# EAGLE design whatnick (EAGLE 7.6.0)
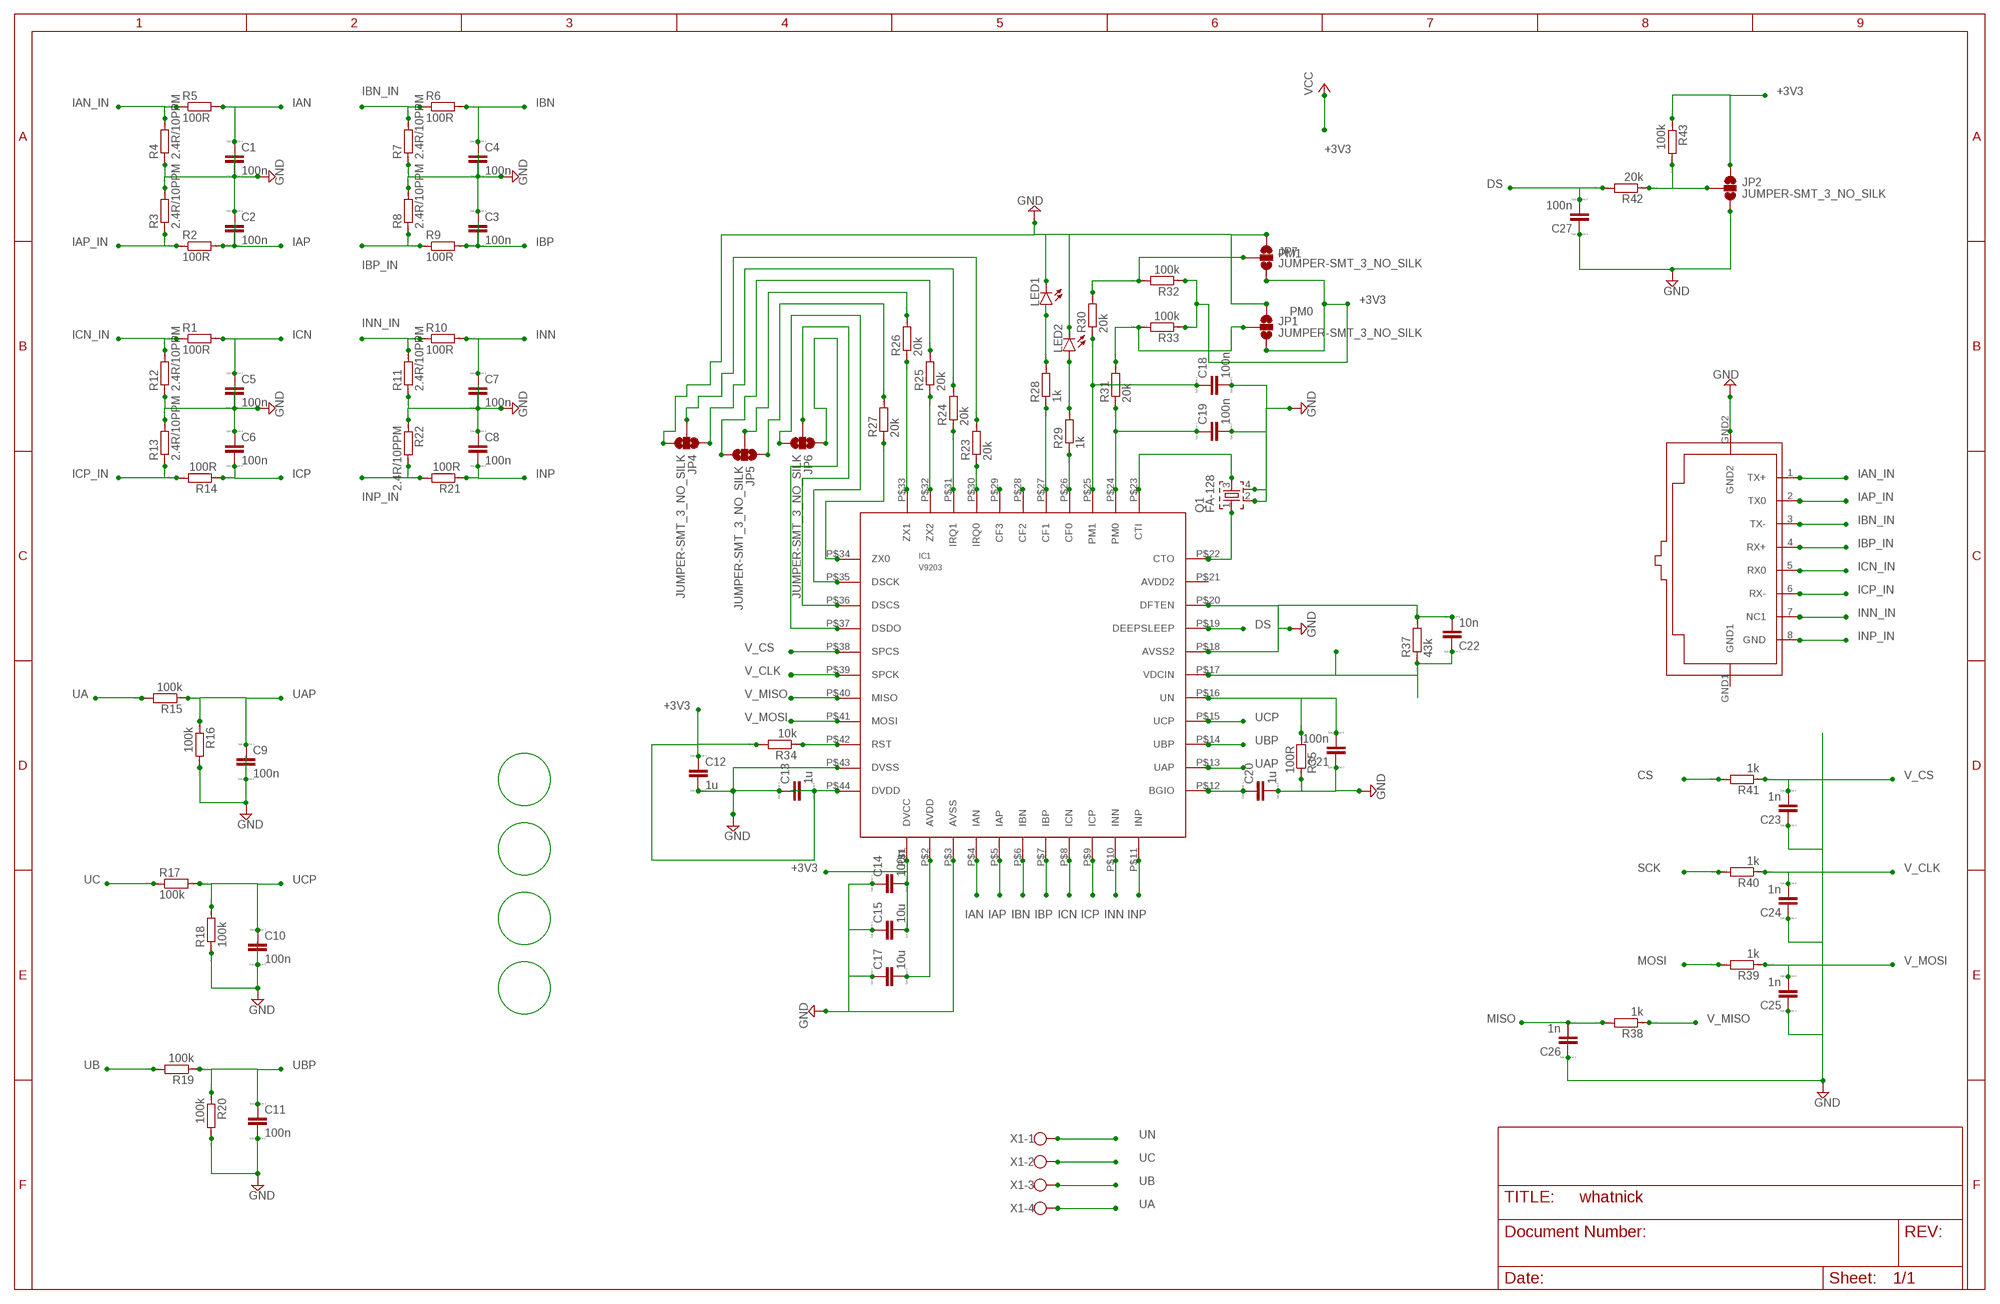
[diagram p0: schematic, sheet 1, part 1 of 2]
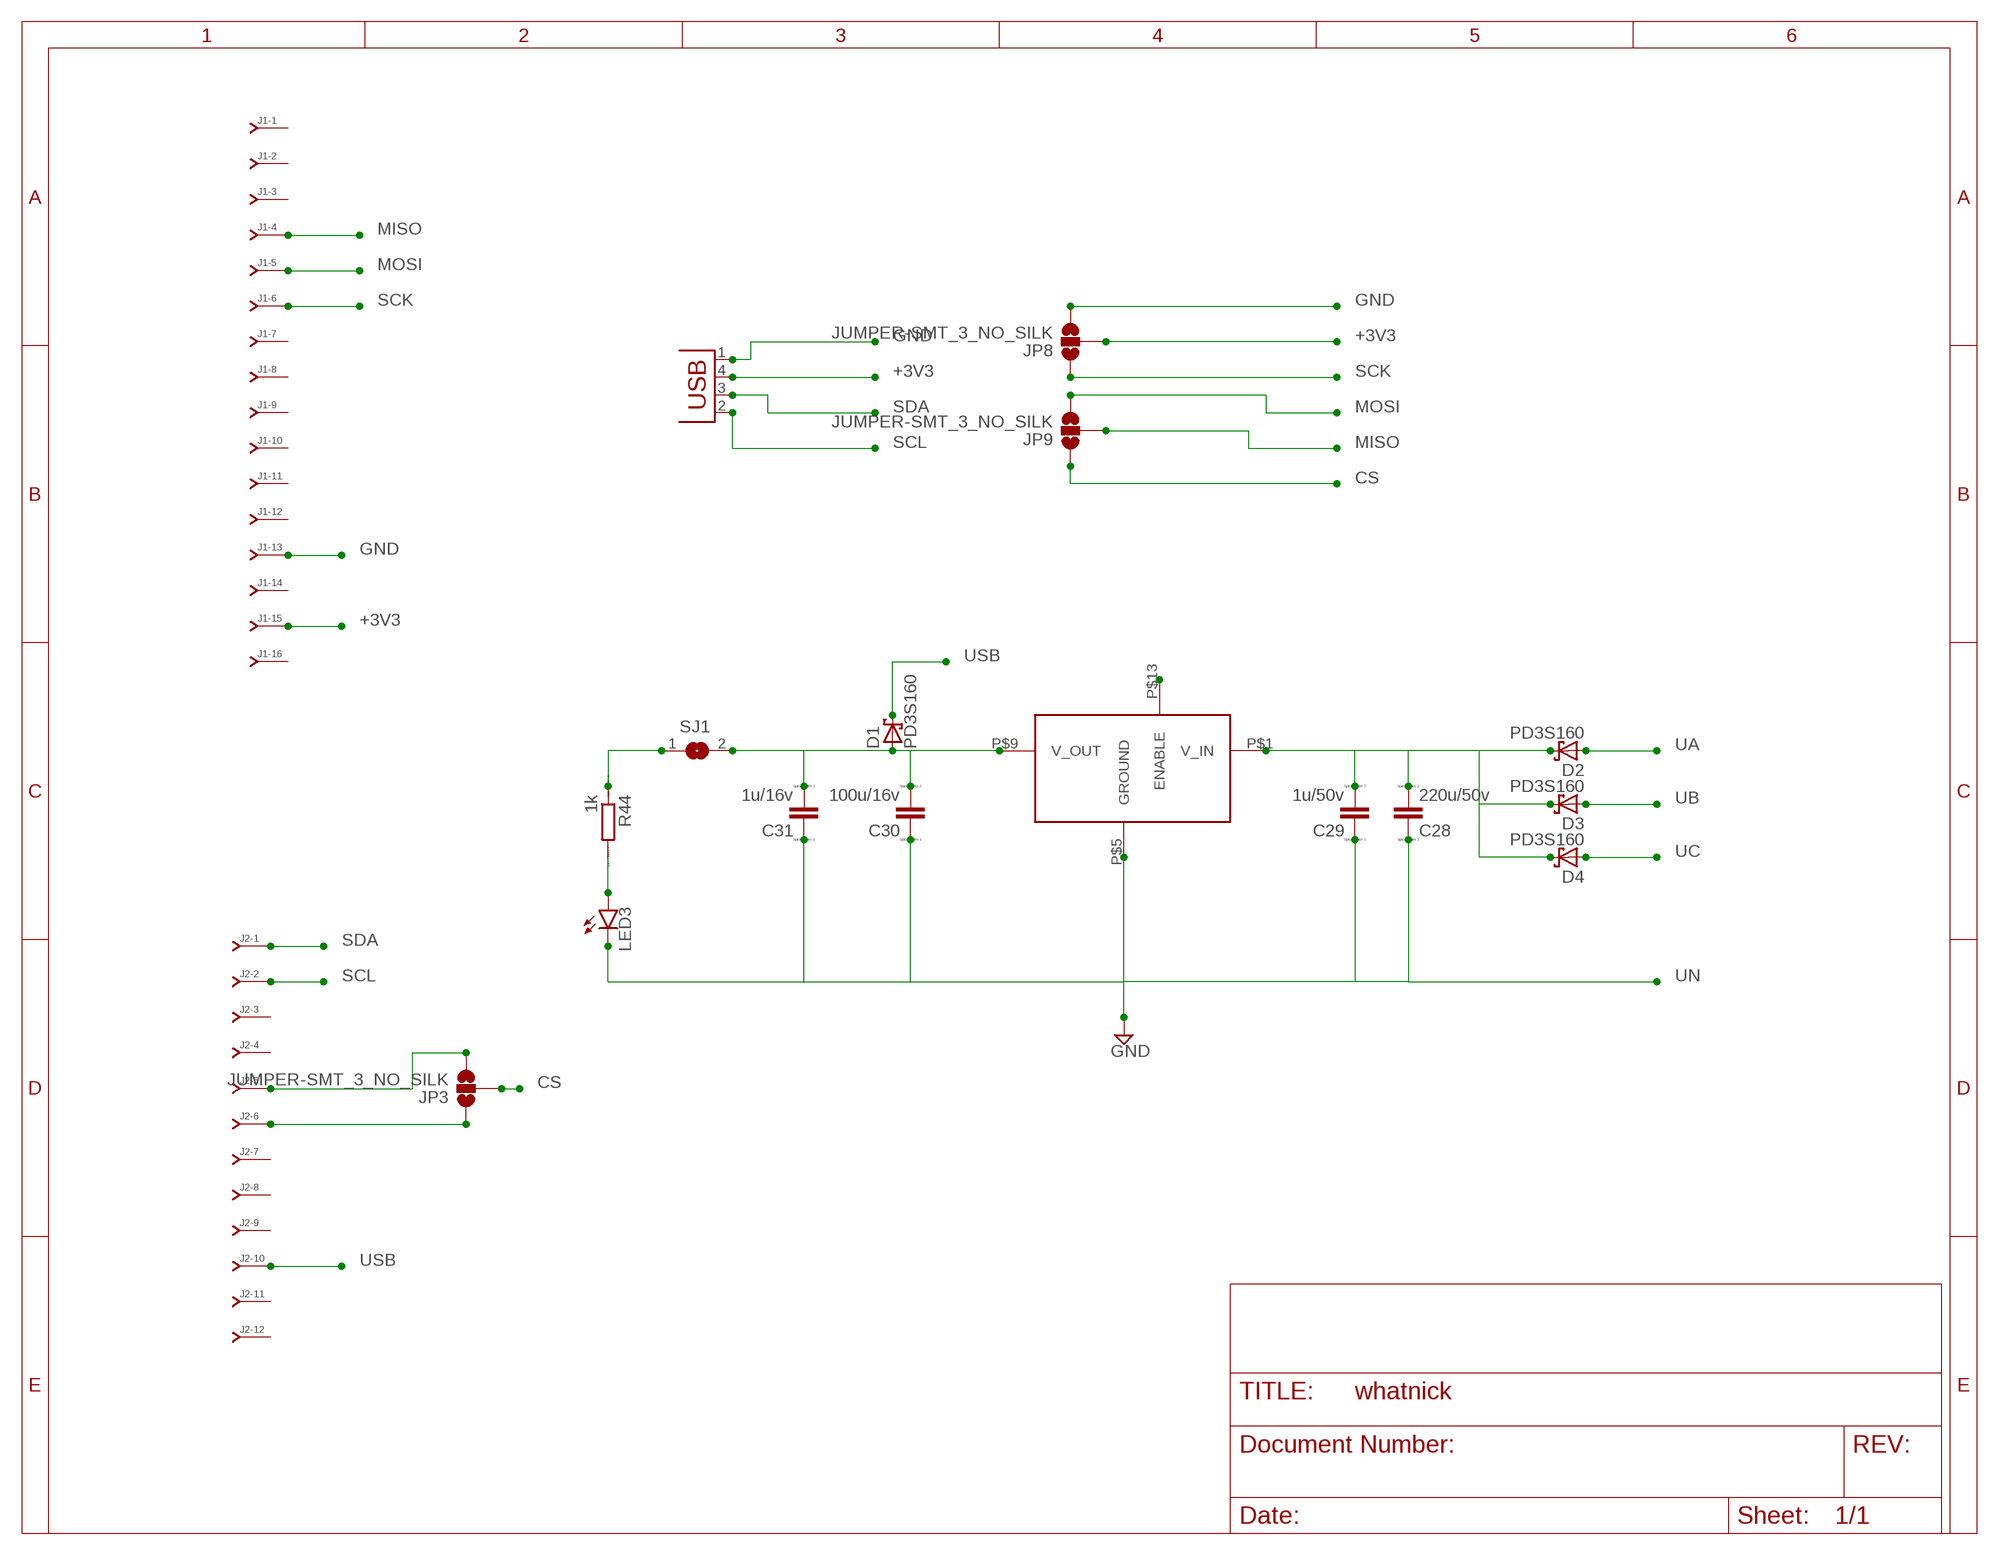
[diagram p1: schematic, sheet 1, part 2 of 2]

## Parts
C1  100n  CC0402  [C0402]
C2  100n  CC0402  [C0402]
C3  100n  CC0402  [C0402]
C4  100n  CC0402  [C0402]
C5  100n  CC0402  [C0402]
C6  100n  CC0402  [C0402]
C7  100n  CC0402  [C0402]
C8  100n  CC0402  [C0402]
C9  100n  CC0402  [C0402]
C10  100n  CC0402  [C0402]
C11  100n  CC0402  [C0402]
C12  1u  CC0402  [C0402]
C13  1u  CC0402  [C0402]
C14  100n  CC0402  [C0402]
C15  10u  CC0402  [C0402]
C17  10u  CC0402  [C0402]
C18  100n  CC0402  [C0402]
C19  100n  CC0402  [C0402]
C20  1u  CC0402  [C0402]
C21  100n  CC0402  [C0402]
C22  10n  CC0402  [C0402]
C23  1n  CC0402  [C0402]
C24  1n  CC0402  [C0402]
C25  1n  CC0402  [C0402]
C26  1n  CC0402  [C0402]
C27  100n  CC0402  [C0402]
C28  220u/50v  CC0402  [C0402]
C29  1u/50v  CC0402  [C0402]
C30  100u/16v  CC0402  [C0402]
C31  1u/16v  CC0402  [C0402]
D1  PD3S160  [POWERDI323]
D2  PD3S160  [POWERDI323]
D3  PD3S160  [POWERDI323]
D4  PD3S160  [POWERDI323]
IC1  V9203  [44LQFP]
J1  J-16-SIP-100  [SIP-100-16]
J2  J-12-SIP-100  [SIP-100-12]
JP1  JUMPER-SMT_3_NO_SILK  [SMT-JUMPER_3_NO_SILK]
JP2  JUMPER-SMT_3_NO_SILK  [SMT-JUMPER_3_NO_SILK]
JP3  JUMPER-SMT_3_NO_SILK  [SMT-JUMPER_3_NO_SILK]
JP4  JUMPER-SMT_3_NO_SILK  [SMT-JUMPER_3_NO_SILK]
JP5  JUMPER-SMT_3_NO_SILK  [SMT-JUMPER_3_NO_SILK]
JP6  JUMPER-SMT_3_NO_SILK  [SMT-JUMPER_3_NO_SILK]
JP7  JUMPER-SMT_3_NO_SILK  [SMT-JUMPER_3_NO_SILK]
JP8  JUMPER-SMT_3_NO_SILK  [SMT-JUMPER_3_NO_SILK]
JP9  JUMPER-SMT_3_NO_SILK  [SMT-JUMPER_3_NO_SILK]
LED1  LEDCHIPLED-0603-TTW  [CHIPLED-0603-TTW]
LED2  LEDCHIPLED-0603-TTW  [CHIPLED-0603-TTW]
LED3  LEDCHIPLED-0603-TTW  [CHIPLED-0603-TTW]
Q1  FA-128  [FA-128]
R1  100R  RR0402  [R0402]
R2  100R  RR0402  [R0402]
R3  2.4R/10PPM  RR0402  [R0402]
R4  2.4R/10PPM  RR0402  [R0402]
R5  100R  RR0402  [R0402]
R6  100R  RR0402  [R0402]
R7  2.4R/10PPM  RR0402  [R0402]
R8  2.4R/10PPM  RR0402  [R0402]
R9  100R  RR0402  [R0402]
R10  100R  RR0402  [R0402]
R11  2.4R/10PPM  RR0402  [R0402]
R12  2.4R/10PPM  RR0402  [R0402]
R13  2.4R/10PPM  RR0402  [R0402]
R14  100R  RR0402  [R0402]
R15  100k  RR1206  [R1206]
R16  100k  RR0402  [R0402]
R17  100k  RR1206  [R1206]
R18  100k  RR0402  [R0402]
R19  100k  RR1206  [R1206]
R20  100k  RR0402  [R0402]
R21  100R  RR0402  [R0402]
R22  2.4R/10PPM  RR0402  [R0402]
R23  20k  RR0402  [R0402]
R24  20k  RR0402  [R0402]
R25  20k  RR0402  [R0402]
R26  20k  RR0402  [R0402]
R27  20k  RR0402  [R0402]
R28  1k  RR0402  [R0402]
R29  1k  RR0402  [R0402]
R30  20k  RR0402  [R0402]
R31  20k  RR0402  [R0402]
R32  100k  RR0402  [R0402]
R33  100k  RR0402  [R0402]
R34  10k  RR0402  [R0402]
R35  100R  RR0402  [R0402]
R37  43k  RR0402  [R0402]
R38  1k  RR0402  [R0402]
R39  1k  RR0402  [R0402]
R40  1k  RR0402  [R0402]
R41  1k  RR0402  [R0402]
R42  20k  RR0402  [R0402]
R43  100k  RR0402  [R0402]
R44  1k  RR0402  [R0402]
SJ1  SJW  [SJW]
U$1  RJ45-TRAFO  [RJ45-TRAFO]
U$2  ROF-78EXX-0.5SMD  [ROF-78EXX-0.5SMD]
X1  W237-4  [W237-4]
X5  USB-JST-2MM-SMT  [S4B-PH]

## Nets
+3V3: C12.1 C13.2 C14.2 C15.2 C22.1 IC1.P$1(DVCC) IC1.P$17(VDCIN) IC1.P$44(DVDD) J1.15 JP1.3 JP2.1 JP7.3 JP8.2 R32.1 R33.1 R34.2 R37.1 R43.1 X5.4(VBUS) ; supply symbol labelled VCC
CS: JP3.2 JP9.1 R41.2
DS: C27.2 IC1.P$19(DEEPSLEEP) R42.2
DSCK: IC1.P$35(DSCK) JP6.3
DSCS: IC1.P$36(DSCS) JP6.2
DSDO: IC1.P$37(DSDO) JP6.1
GND: C1.2 C2.1 C3.1 C4.2 C5.2 C6.1 C7.2 C8.1 C9.2 C10.2 C11.2 C12.2 C13.1 C14.1 C15.1 C17.1 C18.2 C19.2 C20.2 C21.1 C22.2 C23.1 C24.1 C25.1 C26.1 C27.1 IC1.P$3(AVSS) IC1.P$18(AVSS2) IC1.P$20(DFTEN) IC1.P$43(DVSS) J1.13 JP1.1 JP2.3 JP4.3 JP7.1 JP8.3 LED1.C@1(CATHODE) LED2.C@1(CATHODE) Q1.2 Q1.4 R3.2 R4.1 R7.1 R8.2 R11.1 R12.1 R13.2 R16.2 R18.1 R20.2 R22.1 R35.1 R37.2 X5.1(GND)
GND2: U$1.GND2 ; supply symbol labelled GND
IAN: C1.1 IC1.P$4(IAN) R5.2
IAN_IN: R4.2 R5.1 U$1.1(TX+)
IAP: C2.2 IC1.P$5(IAP) R2.2
IAP_IN: R2.1 R3.1 U$1.2(TX0)
IBN: C4.1 IC1.P$6(IBN) R6.2
IBN_IN: R6.1 R7.2 U$1.3(TX-)
IBP: C3.2 IC1.P$7(IBP) R9.2
IBP_IN: R8.1 R9.1 U$1.4(RX+)
ICN: C5.1 IC1.P$8(ICN) R1.2
ICN_IN: R1.1 R12.2 U$1.5(RX0)
ICP: C6.2 IC1.P$9(ICP) R14.1
ICP_IN: R13.1 R14.2 U$1.6(RX-)
INN: C7.1 IC1.P$10(INN) R10.2
INN_IN: R10.1 R11.2 U$1.7(NC1)
INP: C8.2 IC1.P$11(INP) R21.1
INP_IN: R21.2 R22.2 U$1.8(GND)
IRQ0: JP4.2 R23.2
IRQ1: JP4.1 R24.2
MISO: C26.2 J1.4 JP9.2 R38.2
MOSI: J1.5 JP9.3 R39.2
N$1: LED3.A@1(ANODE) R44.2
N$2: JP2.2 R42.1 R43.2
N$3: LED1.A@1(ANODE) R28.2
N$4: IC1.P$23(CTI) Q1.3
N$6: C20.1 IC1.P$12(BGIO)
N$7: LED2.A@1(ANODE) R29.2
N$8: IC1.P$22(CTO) Q1.1
N$9: IC1.P$34(ZX0) R27.1
N$10: IC1.P$28(CF2)
N$11: C21.2 IC1.P$16(UN) R35.2
N$12: IC1.P$29(CF3)
N$13: IC1.P$30(IRQ0) R23.1
N$14: IC1.P$31(IRQ1) R24.1
N$15: IC1.P$32(ZX2) R25.1
N$16: IC1.P$33(ZX1) R26.1
N$19: C19.1 IC1.P$24(PM0) R31.1
N$20: C18.1 IC1.P$25(PM1) R30.1
N$22: IC1.P$27(CF1) R28.1
N$24: IC1.P$26(CF0) R29.1
N$28: IC1.P$42(RST) R34.1
N$37: C17.2 IC1.P$2(AVDD)
N$40: J2.5 JP3.3
N$41: C30.2 C31.2 D1.A SJ1.2 U$2.P$9(V_OUT)
N$48: C28.2 C29.2 D2.C D3.C D4.C U$2.P$1(V_IN)
N$49: J2.6 JP3.1
N$54: U$2.P$13(ENABLE)
N$60: R44.1 SJ1.1
PM0: JP1.2 R31.2 R33.2
PM1: JP7.2 R30.2 R32.2
SCK: J1.6 JP8.1 R40.2
SCL: J2.2 X5.2(D+)
SDA: J2.1 X5.3(D-)
UA: D2.A R15.2 X1.4
UAP: C9.1 IC1.P$13(UAP) R15.1 R16.1
UB: D3.A R19.2 X1.3
UBP: C11.1 IC1.P$14(UBP) R19.1 R20.1
UC: D4.A R17.1 X1.2
UCP: C10.1 IC1.P$15(UCP) R17.2 R18.2
UN: C28.1 C29.1 C30.1 C31.1 LED3.C@1(CATHODE) U$2.P$5(GROUND) X1.1 ; supply symbol labelled GND
USB: D1.C J2.10
V_CLK: C24.2 IC1.P$39(SPCK) R40.1
V_CS: C23.2 IC1.P$38(SPCS) R41.1
V_MISO: IC1.P$40(MISO) R38.1
V_MOSI: C25.2 IC1.P$41(MOSI) R39.1
ZX0: JP5.1 R27.2
ZX1: JP5.2 R26.2
ZX2: JP5.3 R25.2
Unconnected: IC1.P$21(AVDD2) J1.1 J1.2 J1.3 J1.7 J1.8 J1.9 J1.10 J1.11 J1.12 J1.14 J1.16 J2.3 J2.4 J2.7 J2.8 J2.9 J2.11 J2.12 U$1.GND1

## Library data of the parts
C1-C15 C17-C31 = eagle-ltspice:C: CAPACITOR, European symbol; SPICEMODEL: NONE; SPICEPREFIX: C
D1-D4 = diode:PD3S160: 1.0A SURFACE MOUNT SCHOTTKY BARRIER RECTIFIER POWERDI ® 323 Source: http://www.diodes.com/datasheets/ds30899.pdf
IC1 = v9203:V9203
J1 = con-headers-jp:J-16-: HEADER JACK PINS
J2 = con-headers-jp:J-12-: HEADER JACK PINS
JP1-JP9 = SparkFun-Jumpers:JUMPER-SMT_3_NO: Normally open jumper This jumper has three pads in close proximity to each other. Apply solder to close the connection(s).
LED1-LED3 = tango:LED: LED OSRAM: - CHIPLED LG R971, LG N971, LY N971, LG Q971, LY Q971, LO R971, LY R971 LH N974, LH R974 LS Q976, LO Q976, LY Q976 LO Q996 - Hyper CHIPLED LW Q18S LB Q993, LB Q99A, LB R99A - SideLED LS A670, LO A670, LY A670, LG A670, LP A670 LB A673, LV A673, LT A673, LW A673 LH A674 LY A675 LS A676, LA A676, LO A676, LY A676, LW A676 LS A679, LY A679, LG A679 - Hyper Micro SIDELED® LS Y876, LA Y876, LO Y876, LY Y876 LT Y87S - SmartLED LW L88C, LW L88S LB L89C, LB L89S, LG L890 LS L89K, LO L89K, LY L89K LS L896, LA L896, LO L896, LY L896 - TOPLED LS T670, LO T670, LY T670, LG T670, LP T670 LSG T670, LSP T670, LSY T670, LOP T670, LYG T670 LG T671, LOG T671, LSG T671 LB T673, LV T673, LT T673, LW T673 LH T674 LS T676, LA T676, LO T676, LY T676, LB T676, LH T676, LSB T676, LW T676 LB T67C, LV T67C, LT T67C, LS T67K, LO T67K, LY T67K, LW E67C LS E67B, LA E67B, LO E67B, LY E67B, LB E67C, LV E67C, LT E67C LW T67C LS T679, LY T679, LG T679 LS T770, LO T770, LY T770, LG T770, LP T770 LB T773, LV T773, LT T773, LW T773 LH T774 LS E675, LA E675, LY E675, LS T675 LS T776, LA T776, LO T776, LY T776, LB T776 LHGB T686 LT T68C, LB T68C - Hyper Mini TOPLED® LB M676 - Mini TOPLED Santana® LG M470 LS M47K, LO M47K, LY M47K Source: http://www.osram.convergy.de - LUMILED® LXK2-PW12-R00, LXK2-PW12-S00, LXK2-PW14-U00, LXK2-PW14-V00 LXK2-PM12-R00, LXK2-PM12-S00, LXK2-PM14-U00 LXK2-PE12-Q00, LXK2-PE12-R00, LXK2-PE12-S00, LXK2-PE14-T00, LXK2-PE14-U00 LXK2-PB12-K00, LXK2-PB12-L00, LXK2-PB12-M00, LXK2-PB14-N00, LXK2-PB14-P00, LXK2-PB14-Q00 LXK2-PR12-L00, LXK2-PR12-M00, LXK2-PR14-Q00, LXK2-PR14-R00 LXK2-PD12-Q00, LXK2-PD12-R00, LXK2-PD12-S00 LXK2-PH12-R00, LXK2-PH12-S00 LXK2-PL12-P00, LXK2-PL12-Q00, LXK2-PL12-R00 Source: www.luxeon.com
Q1 = crystal:FA-: MHz RANGE CRYSTAL UNIT Source: Epson Toyocom
R1-R35 R37-R44 = eagle-ltspice:R: RESISTOR, European symbol; SPICEMODEL: NONE; SPICEPREFIX: R
SJ1 = jumper:SJ: SMD solder JUMPER
U$1 = con-amphenol-rj45-ld:RJ45-TRAFO: RJ45 socket with integrated magnetics Naming: Amphenol LMJ1598824110DT39 TME RJ45-TRAFO Author: Petr Kalandra <mailto:kalandrap@gmail.com> Datasheet: http://zefiryn.tme.pl/dok/zlacza/rjtrafo.pdf
U$2 = rof-78exx-0.5smd:ROF-78EXX-0.5SMD
X1 = con-wago-500:W237-4: WAGO SCREW CLAMP; OC_FARNELL: unknown; OC_NEWARK: unknown
X5 = DECADE-libraries20151104:USB: USB Connectors USB-B-PTH is fully proven SKU : PRT-00139/CONN-08278 USB-miniB is fully proven SKU : PRT-00587 USB-A-PCB is untested. USB-A-H is throughly reviewed, but untested. Spark Fun Electronics SKU : PRT-00437 USB-B-SMT is throughly reviewed, but untested. Needs silkscreen touching up. USB-A-S has not been used/tested USB-MB-H has not been used/tested USB-MICROB has been used. CONN-09505

## Board
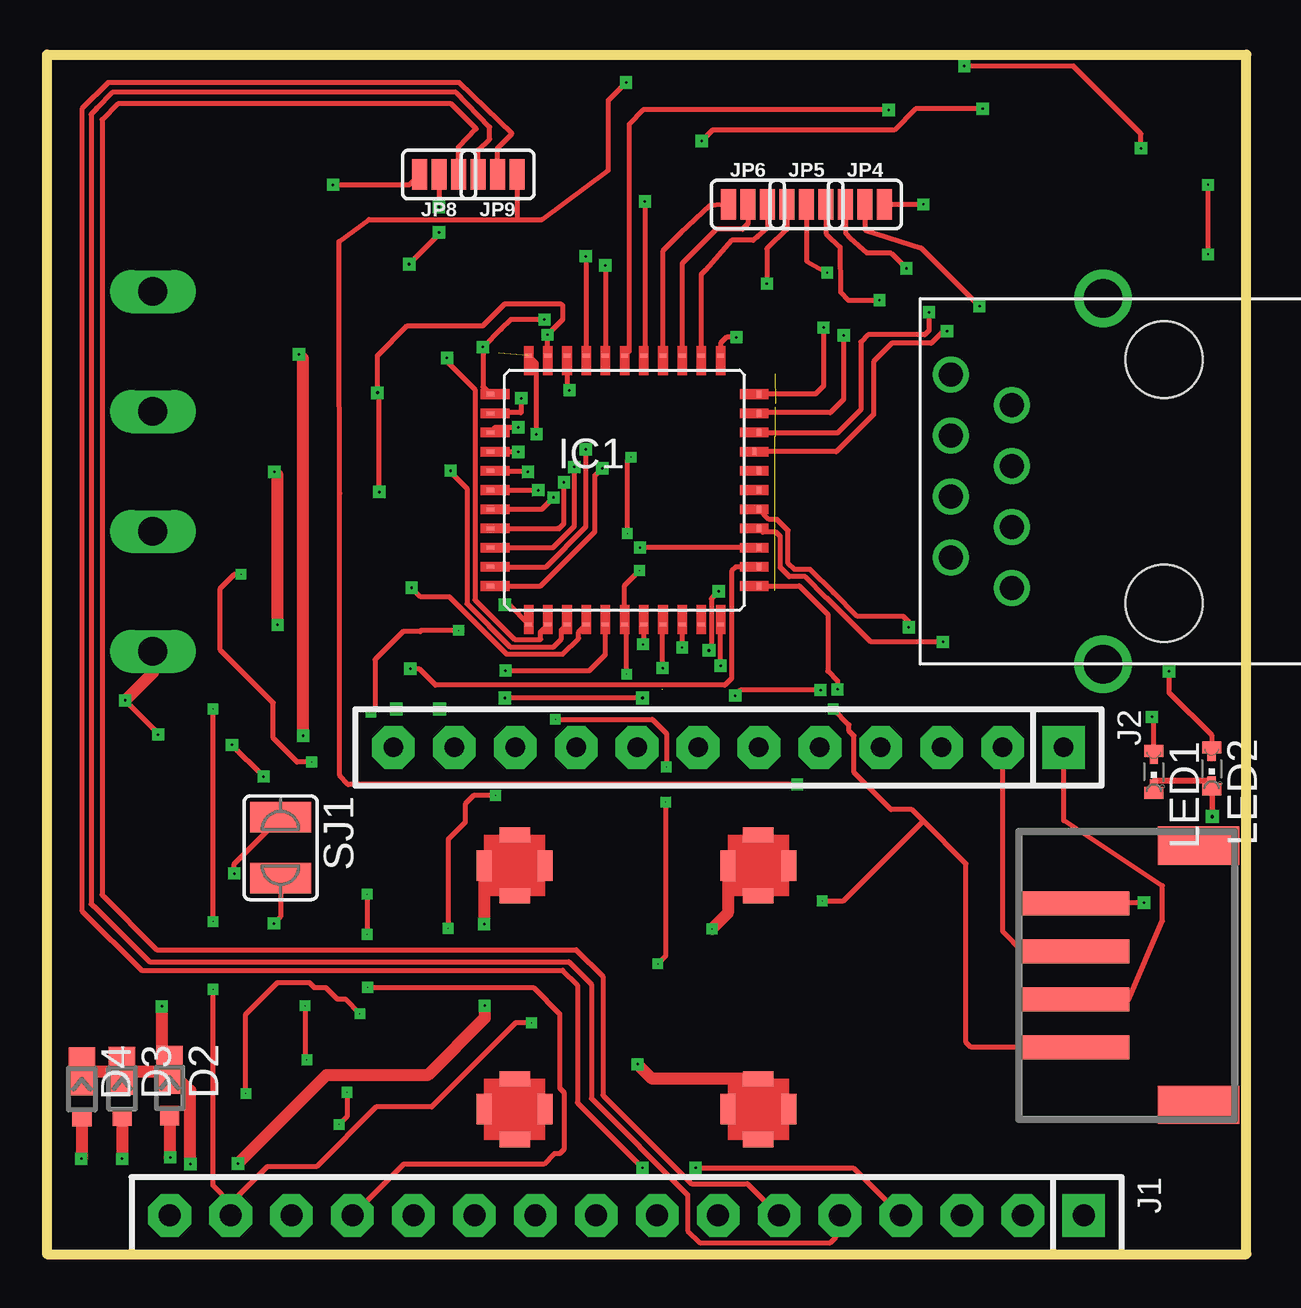
[diagram p2: board, top side]
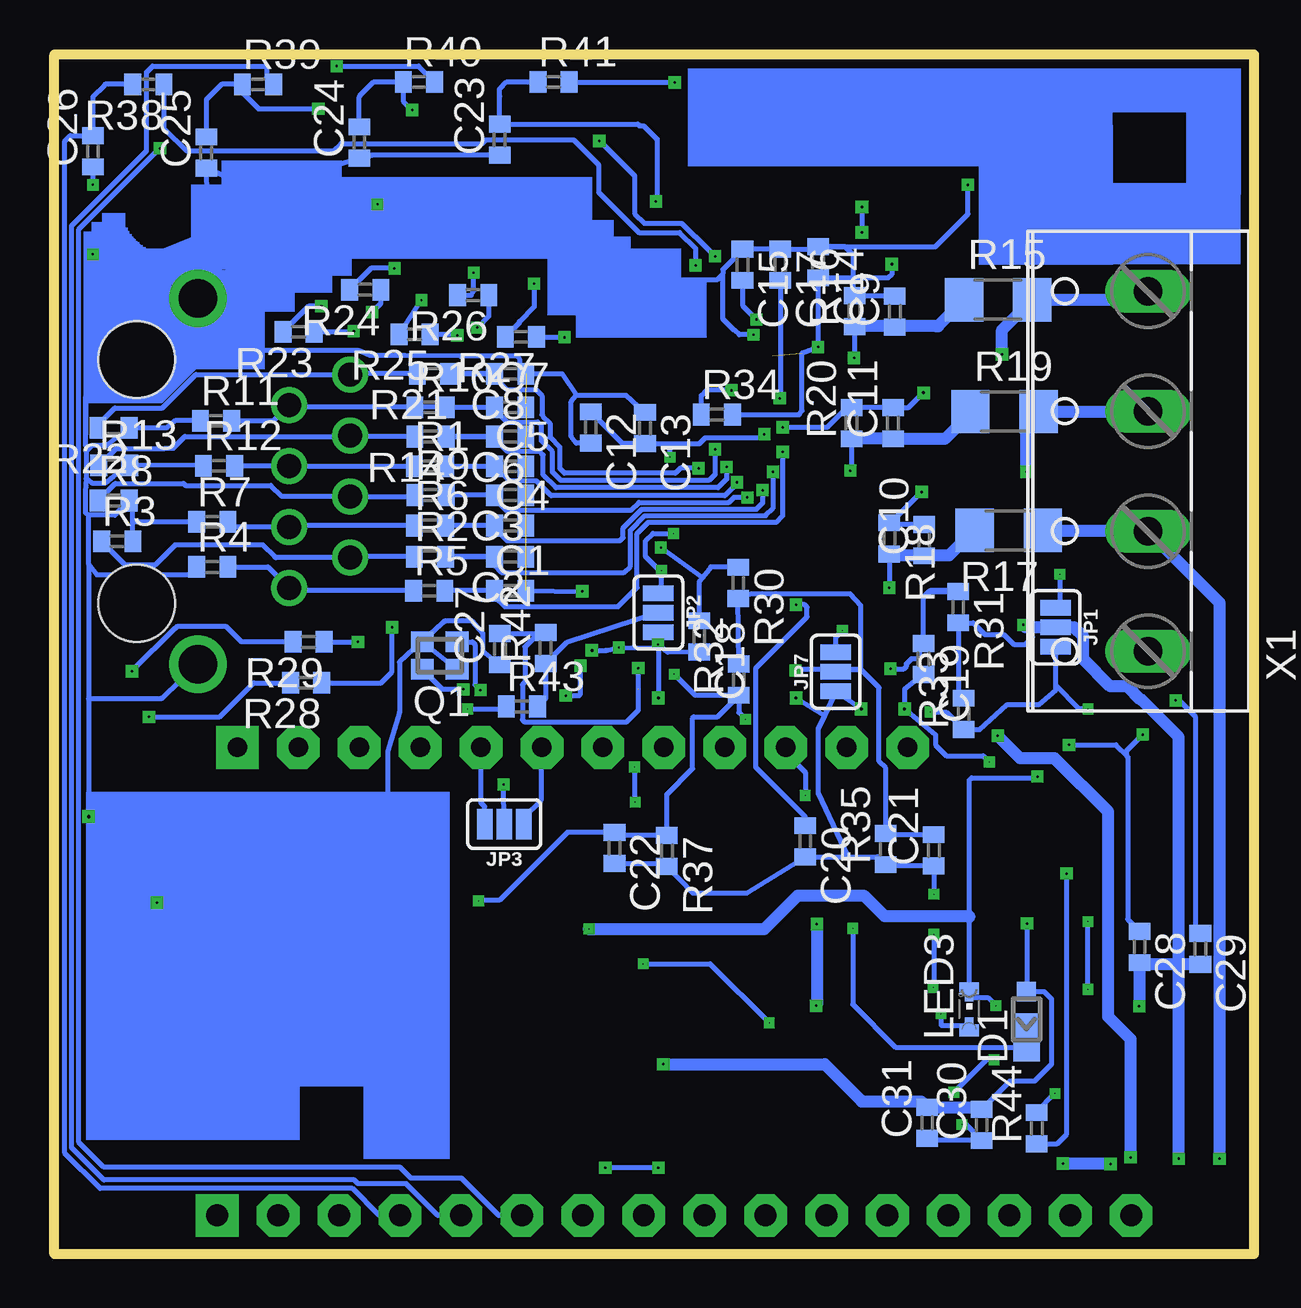
[diagram p3: board, bottom side, seen from below]

No outline drawn. Coordinates in mm, seen from the top.
Copper layers (1*16): Top 0.035mm / dielectric 1.5mm / Bottom 0.035mm
Design rules "default *": minimum track width 10mil, minimum drill 24mil, track to track 8mil, track to pad 8mil, pad to pad 8mil, via to via 8mil, smd to smd 8mil, copper to edge 40mil, drill to drill 8mil, minimum pad ring 5mil, minimum via ring 8mil, stop-mask expansion 4mil, vias tented up to drill 0mil, thermal gap 10mil
Milling: 4 lines

### Footprints (pad centres in the part's own frame; a part is rotated, then mirrored left to right if it is on the bottom)
C0402 = smd 0.7 x 0.9: 1 -0.65,0; 2 0.65,0
POWERDI323 = smd 0.8 x 0.8: A 1.15,0 | smd 2 x 1.1: C -0.75,0
44LQFP = smd 0.305 x 0.152: P$1 -5.4,4; P$2 -5.4,3.2; P$3 -5.4,2.4; P$4 -5.4,1.6; P$5 -5.4,0.8; P$6 -5.4,0; P$7 -5.4,-0.8; P$8 -5.4,-1.6; P$9 -5.4,-2.4; P$10 -5.4,-3.2; P$11 -5.4,-4; P$12 -3.8,-5.6; P$13 -3,-5.6; P$14 -2.2,-5.6; P$15 -1.4,-5.6; P$16 -0.6,-5.6; P$17 0.2,-5.6; P$18 1,-5.6; P$19 1.8,-5.6; P$20 2.6,-5.6; P$21 3.4,-5.6; P$22 4.2,-5.6; P$34 4.2,5.6; P$35 3.4,5.6; P$36 2.6,5.6; P$37 1.8,5.6; P$38 1,5.6; P$39 0.2,5.6; P$40 -0.6,5.6; P$41 -1.4,5.6; P$42 -2.2,5.6; P$43 -3,5.6; P$44 -3.8,5.6 | smd 0.152 x 0.305: P$23 5.8,-4; P$24 5.8,-3.2; P$25 5.8,-2.4; P$26 5.8,-1.6; P$27 5.8,-0.8; P$28 5.8,0; P$29 5.8,0.8; P$30 5.6,1.6; P$31 5.8,2.4; P$32 5.8,3.2; P$33 5.8,4
SIP-100-16 = drill 0.914 pad 1.778 square: 1 -19.05,0 | drill 0.914 pad 1.778 octagon: 2 -16.51,0; 3 -13.97,0; 4 -11.43,0; 5 -8.89,0; 6 -6.35,0; 7 -3.81,0; 8 -1.27,0; 9 1.27,0; 10 3.81,0; 11 6.35,0; 12 8.89,0; 13 11.43,0; 14 13.97,0; 15 16.51,0; 16 19.05,0
SIP-100-12 = drill 0.813 pad 1.778 square: 1 -13.97,0 | drill 0.813 pad 1.778 octagon: 2 -11.43,0; 3 -8.89,0; 4 -6.35,0; 5 -3.81,0; 6 -1.27,0; 7 1.27,0; 8 3.81,0; 9 6.35,0; 10 8.89,0; 11 11.43,0; 12 13.97,0
SMT-JUMPER_3_NO_SILK = smd 0.635 x 1.27: 1 -0.813,0; 2 0,0; 3 0.813,0
CHIPLED-0603-TTW = smd 0.8 x 0.5: A 0,-0.875; C 0,0.875 | smd 0.35 x 0.35: A@1 0,-0.5; C@1 0,0.5
FA-128 = smd 0.95 x 0.85: 1 -0.725,-0.575; 2 0.725,-0.575; 3 0.725,0.575; 4 -0.725,0.575
R0402 = smd 0.7 x 0.9: 1 -0.65,0; 2 0.65,0
R1206 = smd 1.6 x 1.803: 1 -1.422,0; 2 1.422,0
SJW = smd 1.27 x 2.54: 1 -1.27,0; 2 1.27,0
RJ45-TRAFO = drill 1: 1 -4.445,6.35; 2 -3.175,8.89; 3 -1.905,6.35; 4 -0.635,8.89; 5 0.635,6.35; 6 1.905,8.89; 7 3.175,6.35; 8 4.445,8.89 | drill 1.6: GND1 -7.62,2.54; GND2 7.62,2.54 | hole 3.2: -5.08,0; 5.08,0
ROF-78EXX-0.5SMD = smd 0.635 x 1.27: P$1 -12.7,8.89; P$3 -10.16,8.89; P$5 -2.54,8.89; P$7 0,8.89; P$10 0,-1.27; P$12 -2.54,-1.27; P$13 -10.16,-1.27; P$15 -12.7,-1.27 | smd 1.27 x 0.635: P$2 -11.43,10.16; P$4 -11.43,7.62; P$6 -1.27,10.16; P$8 -1.27,7.62; P$9 -1.27,0; P$11 -1.27,-2.54; P$14 -11.43,0; P$16 -11.43,-2.54
W237-4 = drill 1.194 long: 1 -7.5,-1.27; 2 -2.5,-1.27; 3 2.5,-1.27; 4 7.5,-1.27
S4B-PH = smd 1 x 4.6: 1 -3,-4.7; 2 -1,-4.7; 3 1,-4.7; 4 3,-4.7 | smd 1.6 x 3.4: P$1 -5.4,0.5; P$2 5.4,0.5

### Placement (x,y rotation side)
C1  46,52.65 0 bottom
C2  46,54.08 180 bottom
C3  46,56.64 180 bottom
C4  46,55.37 0 bottom
C5  46,57.84 0 bottom
C6  46,59.08 180 bottom
C7  46,60.3 0 bottom
C8  46,61.7 180 bottom
C9  29.97,64.29 90 bottom
C10  28.75,54.76 90 bottom
C11  30.05,59.64 90 bottom
C12  42.65,59.46 270 bottom
C13  40.39,59.44 270 bottom
C14  33.17,66.34 270 bottom
C15  36.32,66.24 270 bottom
C17  34.75,66.24 270 bottom
C18  38.13,50.75 270 bottom
C19  28.78,49.81 270 bottom
C20  33.71,42.21 270 bottom
C21  28.35,41.83 90 bottom
C22  41.66,41.94 270 bottom
C23  46.44,71.46 90 bottom
C24  52.29,71.34 90 bottom
C25  58.67,70.92 90 bottom
C26  63.4,70.97 90 bottom
C27  46.43,50.22 90 bottom
C28  19.77,37.81 270 bottom
C29  17.24,37.73 270 bottom
C30  26.35,30.39 90 bottom
C31  28.62,30.47 90 bottom
D1  24.49,34.8 90 bottom
D2  20.12,31.93 270 top
D3  18.14,31.9 270 top
D4  16.46,31.88 270 top
IC1  38.88,56.85 0 top
J1  39.17,26.62 180 top
J2  43.41,46.12 180 top
JP1  23.27,51.13 270 bottom
JP2  39.83,51.74 270 bottom
JP3  46.25,42.93 180 bottom
JP4  49.1,68.76 0 top
JP5  46.66,68.76 0 top
JP6  44.22,68.76 0 top
JP7  32.44,49.28 90 bottom
JP8  31.34,70 180 top
JP9  33.78,70 180 top
LED1  61.14,45.11 180 top
LED2  63.55,45.24 180 top
LED3  26.87,35.2 0 bottom
Q1  48.94,49.95 180 bottom
R1  49.35,57.84 0 bottom
R2  49.35,54.08 0 bottom
R3  62.38,54.71 0 bottom
R4  58.42,53.64 0 bottom
R5  49.38,52.65 0 bottom
R6  49.35,55.37 0 bottom
R7  58.42,55.52 0 bottom
R8  62.53,56.41 0 bottom
R9  49.33,56.64 0 bottom
R10  49.33,60.3 0 bottom
R11  58.27,59.74 0 bottom
R12  58.14,57.86 0 bottom
R13  62.51,57.89 0 bottom
R14  49.33,59.08 180 bottom
R15  25.67,64.78 0 bottom
R16  31.65,64.31 90 bottom
R17  25.22,55.17 180 bottom
R18  30.2,54.84 270 bottom
R19  25.4,60.12 0 bottom
R20  31.78,59.64 90 bottom
R21  49.23,61.7 180 bottom
R22  62.53,59.44 180 bottom
R23  54.82,63.44 180 bottom
R24  52.05,65.2 180 bottom
R25  49.99,63.34 180 bottom
R26  47.55,64.98 180 bottom
R27  45.56,63.24 180 bottom
R28  54.51,48.82 180 bottom
R29  54.41,50.52 180 bottom
R30  36.5,52.98 270 bottom
R31  27.33,51.97 270 bottom
R32  36.47,48.95 90 bottom
R33  27.1,47.52 90 bottom
R34  37.39,59.99 0 bottom
R35  30.35,41.88 90 bottom
R37  39.47,41.81 270 bottom
R38  61.09,73.76 180 bottom
R39  56.52,73.76 0 bottom
R40  49.81,73.86 0 bottom
R41  44.2,73.86 0 bottom
R42  44.53,50.27 90 bottom
R43  45.52,47.83 0 bottom
R44  24.05,30.25 90 bottom
SJ1  24.74,41.94 270 top
U$1  61.57,57.21 90 top
U$2  45.93,32.31 0 top
X1  20.68,57.63 90 bottom
X5  62.51,36.63 270 top

### Tracks (layer width: path | path; a pad name or v marks a point on that pad's centre or on a via)
+3V3  (via drill 0.04 pad 0.13, 0.1 pad 0.13, 0.12)  (1 unrouted)
  Top 0.203: IC1.P$1 33.17,61.16 v33.17,62.81 33.91,63.55 33.93,63.55 34.34,63.96 v35.74,63.96 | v35.41,59.18 35.41,62.12 IC1.P$44 | JP8.2 v31.34,68.66 | v31.34,67.59 31.34,67.51 v30.1,66.27 | v39.7,53.49 39.08,52.87 IC1.P$17 39.17,51.16 v39.17,49.17 | v39.19,55.04 39.19,58.06 v39.34,58.22 | v32.16,51 30.61,51 30.56,50.95 29.84,50.95 28.68,49.78 28.68,47.78 v28.5,47.6 | X5.4 53.52,33.63 53.31,33.83 53.31,41.27 51.54,43.05 | 51.54,43.05 51.05,43.54 50.19,43.54 48.64,45.09 48.64,46.61 48.44,46.81 48.44,47.07 v47.78,47.73 | v47.32,39.73 48.21,39.73 51.54,43.05 | J1.15 22.66,27.13 | 22.66,27.13 21.92,27.86 v21.92,36.04 | v21.92,38.86 v21.92,47.73 | v36.2,47.3 40.23,47.3 40.82,46.71 v40.82,45.31 | v40.79,43.84 40.79,37.44 v40.46,37.11 | v35.2,34.65 34.54,34.65 31.04,31.14 28.73,31.14 26.24,28.65 24.18,28.65 22.66,27.13
  Bottom 0.203: C15.2 36.32,64.54 v35.74,63.96 | R34.2 33.96,59.99 33.83,60.15 33.83,62.56 v33.17,62.81 C14.2 30.25,65.68 30.1,65.84 v30.1,66.27 | 39.37,58.79 C13.2 41.32,58.79 C12.1 | 39.37,58.79 38.12,58.79 37.87,59.03 35.56,59.03 v35.41,59.18 | v31.34,68.66 v31.34,67.59 | 23.27,48.72 23.27,48.51 23.98,47.9 25.3,47.9 26.44,46.86 R33.1 27.83,47.6 v28.5,47.6 | 23.27,48.72 JP1.3 | v39.7,53.49 39.7,53.44 | 39.7,52.81 39.7,52.68 JP2.1 39.83,52.68 39.7,52.81 | 39.7,52.81 39.7,53.44 | 39.7,53.44 39.73,53.44 40.36,54.08 40.36,54.74 40.06,55.04 v39.19,55.04 | v39.34,58.22 39.34,58.76 39.37,58.79 | JP7.3 32.44,50.72 v32.16,51 | v47.78,47.73 46.27,47.73 R43.1 | v47.32,39.73 47.3,39.75 46.46,39.75 43.62,42.59 C22.1 41.53,42.46 R37.1 39.47,44.17 38.41,45.24 38.41,47.35 38.35,47.4 37.37,47.4 R32.1 | R32.1 38.29,48.3 v39.17,49.17 | v21.92,36.04 v21.92,38.86 | v21.92,47.73 22.28,47.73 23.27,48.72 | R32.1 36.47,47.57 v36.2,47.3 | v40.82,45.31 40.82,43.87 v40.79,43.84 | v40.46,37.11 37.67,37.11 v35.2,34.65
CS  (via drill 0.08 pad 0.25, 0.1 pad 0.13)
  Top 0.203: v39.14,73.84 38.41,73.1 38.41,70.18 35.64,68.12 34.59,68.12 | v46.28,44.58 27.56,44.58 27.2,44.96 27.2,56.72 27.18,63.91 27.18,67.21 28.42,68.12 34.59,68.12 | JP9.1 34.59,68.12
  Bottom 0.203: v39.14,73.84 43.52,73.84 R41.2 | JP3.2 v46.28,44.58
DS  (via drill 0.1 pad 0.13)  (1 unrouted)
  Top 0.203: v40.66,49.43 40.66,51.24 IC1.P$19
  Bottom 0.203: C27.2 44.58,50.87 R42.2 44.79,50.92 45.39,50.32 45.39,48.84 45.49,48.74 45.49,47.27 45.41,47.19 41.15,47.19 40.66,47.68 40.66,48.54 | 40.66,48.56 v40.66,49.43
DSCK
  Top 0.203: IC1.P$35 42.27,62.47 42.27,65.84 42.44,66.02 43.54,67.26 44.45,67.26 44.63,67.41 45.03,67.77 JP6.3
DSCS
  Top 0.203: IC1.P$36 41.48,66.29 42.9,67.72 43.99,67.72 44.22,67.94 JP6.2
DSDO
  Top 0.203: IC1.P$37 40.66,62.47 40.66,66.8 41.41,67.55 42.65,68.71 JP6.1
GND  (via drill 0.04 pad 0.13, 0.08 pad 0.25, 0.09, 0.12)  (7 unrouted)
  Top 0.203: v63.4,69.57 v63.4,66.67 | JP4.3 v51.54,68.76 | IC1.P$20 v41.48,50.29 | IC1.P$18 v39.85,50.42 | IC1.P$43 35.87,62.45 v35.87,63.32 36.5,63.96 36.5,64.54 36.42,64.62 34.09,64.62 33.17,63.7 30.02,63.7 28.78,62.46 v28.78,60.91 28.85,60.83 v28.85,56.77 | v26.92,69.57 30.1,69.57 JP8.3 | v34.65,59.46 33.69,59.46 IC1.P$3 | v63.58,43.26 63.58,44.74 LED2.C@1 61.19,44.74 LED1.C@1 61.14,44.73 63.55,44.73 63.55,44.76 63.58,44.76 | 63.6,44.76 63.58,44.76 | 63.58,44.76 v63.58,43.23 | v60.73,39.65 57.83,39.65 X5.1 | v43,52.63 42.7,52.32 42.7,50.29 v42.6,50.16 | v29.57,47.73 v31.37,47.73 | v39.83,48.18 v34.09,48.18 | v26.04,45.52 25.43,45.52 24.43,46.51 24.43,47.98 22.23,50.19 22.23,52.76 22.81,53.34 v23.09,53.34 | v28.35,40.01 v28.35,38.33 | v28.37,36.12 35.28,36.12 36.37,35.03 36.37,31.93 36.55,31.75 36.55,29.36 36.37,29.18 36.14,29.18 35.71,28.75 29.87,28.75 J1.13
  Bottom 0.051: 63.63,58.65 63.7,59.16
  Bottom 0.203: R3.2 61.73,55.47 | 61.73,55.47 61.73,56.26 R8.2 62.48,55.8 63.58,55.8 | R7.1 61.68,55.52 61.73,55.47 | 31.93,41.56 C20.2 36.14,40.06 38.41,40.06 R37.2 39.6,41.28 C22.2 | 31.93,41.56 30.68,41.56 R35.1 30.3,41.18 C21.1 v28.35,40.01 | R11.1 59.97,59.74 60.33,59.44 R22.1 62.84,58.7 63.45,58.7 | 63.45,58.7 63.68,58.47 63.68,57.33 | 63.58,55.8 63.68,55.88 63.7,55.91 63.7,56.67 63.68,57.17 63.68,57.33 | 63.68,57.33 63.45,57.15 62.89,57.15 62.53,57.43 R13.2 R12.1 | R4.1 59.31,53.31 63.22,53.31 | 63.58,53.77 63.58,55.8 | 56.52,69.32 C24.1 51.77,70.81 C23.1 | 56.52,69.32 C25.1 58.62,66.67 | C26.1 v63.4,69.57 | 63.17,66.67 v63.4,66.67 58.62,66.67 | 56.52,69.32 v51.54,68.76 50.44,67.67 43.89,67.67 41.83,65.61 37.39,65.61 37.19,65.81 | 58.62,66.67 61.28,63.68 | 61.28,63.68 63.6,61.06 63.7,60.53 63.7,59.16 | 63.45,58.7 63.6,58.57 63.63,58.65 | v39.85,50.42 JP2.3 | v39.85,50.42 39.85,50.27 v41.48,50.29 42.01,50.16 v42.6,50.16 | 39.45,50.09 v39.85,50.42 | C12.2 43.26,58.8 43.46,59.08 43.46,60.53 43.23,60.81 | 43.23,60.81 41.17,60.81 C13.1 | 43.23,60.81 43.84,61.7 C8.1 45.59,62.03 45.59,62.28 45.7,62.43 48.08,62.43 50.39,62.46 51.84,62.46 52.32,62.66 57.2,62.66 61.28,63.68 | v35.87,63.32 36.45,63.32 36.63,63.5 36.65,63.5 37.13,63.98 37.13,65.81 | 37.13,65.81 37.13,65.86 | 37.13,65.86 37.19,65.81 | 37.13,65.86 37.13,66.04 36.32,66.85 C15.1 C17.1 33.17,66.89 C14.1 | 37.13,65.81 37.19,65.81 | C9.2 31.65,64.94 R16.2 31.7,64.96 31.7,66.65 32.05,67 33.16,67 C14.1 | C14.1 28.28,67 26.92,68.35 v26.92,69.57 | v34.65,59.46 32.79,59.46 31.96,60.29 R20.2 C11.2 29.4,60.29 v28.78,60.91 | C10.2 30.12,55.41 R18.1 30.14,55.49 v28.85,56.77
  Bottom 0.203: 63.25,53.34 63.22,53.31 | 63.22,53.31 63.58,53.77 | 63.58,53.77 63.58,48.16 | 63.58,48.16 v63.58,43.26 | v63.58,43.23 63.58,40.06 63.17,39.65 v60.73,39.65 59.89,40.56 51.1,43.61 51.1,45.95 50.62,47.6 50.62,49.68 50.04,50.22 49.33,50.85 48.72,51.38 | Q1.4 Q1.2 48.74,51.38 48.72,51.38 | C27.1 47.14,50.11 47.14,50.88 | 47.14,50.88 47.57,51.38 | C7.2 45.36,60.45 | C1.2 v43,52.63 | 47.14,50.88 47.55,51.36 47.57,51.38 | 47.57,51.38 48.72,51.38 | 63.58,48.16 60.55,48.16 60.55,48.18 60.5,48.18 59.77,48.92 | 29.57,48.54 C19.2 28.87,49.16 29.13,48.9 29.57,48.54 | 29.57,47.75 v29.57,47.73 | v31.37,47.73 JP7.1 32.91,47.46 | 32.91,47.46 33.17,46.89 33.17,44.22 31.93,41.56 | C18.2 39.45,50.09 | 39.45,50.09 39.75,50.34 39.83,50.39 v39.83,48.18 | v34.09,48.18 32.91,47.46 | 29.57,48.54 29.57,47.75 | 29.57,47.75 28.27,46.66 28.27,46.23 27.81,45.77 26.29,45.77 v26.04,45.52 | v23.09,53.34 23.09,52.12 JP1.1 | v28.35,38.33 28.35,36.14 v28.37,36.12
IAN  (via drill 0.1 pad 0.13)
  Top 0.203: IC1.P$4 v34.64,58.45 v34.65,58.45
  Bottom 0.203: R5.2 C1.1 46.65,52.41 46.23,51.99 41.5,51.99 40.72,52.78 40.72,55.04 40.34,55.42 40.26,55.5 34.92,55.5 34.65,55.78 v34.65,58.45
IAN_IN
  Bottom 0.203: R5.1 55.1,52.65 U$1.1 56.09,53.65 R4.2
IAP  (via drill 0.1 pad 0.13)
  Top 0.203: IC1.P$5 35.01,57.65 v35.05,57.61
  Bottom 0.203: C2.2 R2.2 46.71,54.08 46.66,54.03 46.66,53.7 46.38,53.42 41.25,53.42 41,53.67 41,55.17 40.39,55.78 35.36,55.78 35.05,56.08 v35.05,57.61
IAP_IN
  Bottom 0.203: R2.1 52.64,54.08 U$1.2 55.77,54.04 55.78,54.05 55.8,54.05 56.31,54.56 59.97,54.56 60.81,53.72 62.04,53.72 R3.1
IBN  (via drill 0.1 pad 0.13)
  Top 0.203: IC1.P$6 v35.48,56.85 v35.48,56.84
  Bottom 0.203: R6.2 C4.1 46.65,55.26 46.13,54.74 41.43,54.74 41.3,54.86 41.3,55.27 40.51,56.06 35.74,56.06 35.48,56.31 v35.48,56.84
IBN_IN
  Bottom 0.203: R6.1 55.15,55.37 U$1.3 57.55,55.31 R7.2
IBP  (via drill 0.1 pad 0.13)
  Top 0.203: IC1.P$7 35.63,56.05 v36.12,56.54
  Bottom 0.203: R9.2 C3.2 46.65,56.48 46.18,56.01 40.97,56.01 40.64,56.34 36.88,56.34 36.68,56.54 v36.12,56.54
IBP_IN
  Bottom 0.203: R9.1 50.04,56.58 U$1.4 52.69,56.59 55.52,56.59 55.98,57.05 59.54,57.05 59.61,57.12 62.46,57.12 R8.1
ICN  (via drill 0.1 pad 0.13)
  Top 0.203: IC1.P$8 36.29,55.25 36.3,55.24 36.35,55.24 36.55,55.45 v36.55,57.17
  Bottom 0.203: R1.2 C5.1 46.04,57.23 44.91,57.23 44.3,56.62 37.06,56.62 36.55,57.12 v36.55,57.17
ICN_IN
  Bottom 0.203: 57.48,57.85 R12.2 U$1.5 55.2,57.84 R1.1
ICP  (via drill 0.1 pad 0.13)
  Top 0.203: IC1.P$9 36.09,54.45 36.98,55.35 v36.98,57.81
  Bottom 0.203: C6.2 R14.1 46.69,59.08 46.63,59.03 46.63,58.98 46.13,58.47 44.78,58.47 44.63,58.32 44.63,57.48 44.09,56.95 37.34,56.95 36.98,57.3 v36.98,57.81
ICP_IN
  Bottom 0.203: R14.2 52.64,59.08 U$1.6 52.71,59.08 59.56,59.08 60.05,58.6 60.4,58.6 60.43,58.57 62.43,58.57 63.12,57.89 R13.1
INN  (via drill 0.1 pad 0.13)
  Top 0.203: IC1.P$10 35.8,53.65 37.47,55.32 v37.47,58.55
  Bottom 0.203: 55.3,60.27 55.27,60.3 R10.2 C7.1 46.65,60.21 46.13,59.69 44.86,59.69 44.7,59.54 44.7,58.9 44.25,58.45 44.25,57.61 43.89,57.25 37.72,57.25 37.47,57.51 v37.47,58.55
INN_IN
  Bottom 0.203: R10.1 55.13,60.3 U$1.7 55.86,59.74 R11.2
INP  (via drill 0.1 pad 0.13)
  Top 0.203: IC1.P$11 35.58,52.85 37.85,55.12 37.85,57.45 v38.15,57.76
  Bottom 0.203: C8.2 R21.1 46.76,61.7 46.69,61.62 46.69,61.57 46.15,61.04 44.93,61.04 44.68,60.78 44.68,59.99 44.65,59.97 44.65,59.94 44.35,59.64 44.35,59.05 43.94,58.65 43.94,57.76 43.74,57.56 39.12,57.56 38.91,57.76 v38.15,57.76
INP_IN
  Bottom 0.203: R21.2 52.64,61.7 U$1.8 59.11,61.67 60.5,60.27 62.48,60.27 63.19,59.57 R22.2
IRQ0  (via drill 0.1 pad 0.13)
  Top 0.203: v53.87,64.52 51.45,66.94 49.1,67.69 JP4.2
  Bottom 0.203: v53.87,64.52 54.4,64.52 R23.2
IRQ1  (via drill 0.1 pad 0.13)
  Top 0.203: v50.83,66.09 50.2,66.72 49.17,66.73 48.49,67.33 48.28,67.56 JP4.1
  Bottom 0.203: v50.83,66.09 51.81,66.09 R24.2
MISO  (via drill 0.1 pad 0.13)
  Top 0.203: v39.83,28.6 37.11,31.32 37.11,36.22 36.5,36.83 18.95,36.83 16.46,39.32 16.46,72.75 17.55,73.84 32.18,73.84 34.38,71.71 33.78,71.09 JP9.2 | v42.04,28.6 48.61,28.6 J1.4
  Bottom 0.203: v39.83,28.6 v42.04,28.6 | R38.2 62.89,73.76 62.92,73.74 62.92,73.71 63.4,73.23 C26.2 64.34,71.63 64.57,71.4 64.57,29.21 63.09,27.74 52.58,27.74 51.46,26.62 J1.4
MOSI
  Top 0.203: J1.5 48.06,25.91 47.88,25.73 47.88,25.7 47.65,25.48 42.22,25.48 41.71,25.98 41.71,27.48 37.69,31.5 37.69,36.25 36.75,37.19 19.28,37.19 16.97,39.5 16.94,39.5 16.84,39.6 16.84,72.52 17.07,72.75 17.07,72.77 17.73,73.43 32.05,73.43 33.45,71.98 33.45,71.48 32.97,71.02 JP9.3 | J1.5
  Bottom 0.203: J1.5 49.02,26.62 50.34,27.94 52.35,27.94 52.5,28.09 62.94,28.09 64.29,29.44 64.29,67.87 61.16,70.99 61.16,74.27 60.91,74.52 56.19,74.52 56.16,74.5 56.16,74.06 R39.2
N$1  (via drill 0.04 pad 0.13)
  Top 0.203: v23.29,31.7 23.29,35 24.61,36.32 25.93,36.32 26.14,36.12 26.62,36.12 27.1,35.64 27.43,35.64 v28.04,35.03
  Bottom 0.203: R44.2 24.05,30.94 v23.29,31.7 | v28.04,35.03 28.04,34.54 27.03,34.54 LED3.A@1
N$2
  Bottom 0.203: JP2.2 43.65,50.49 R42.1 44.53,48.17 R43.2
N$3  (via drill 0.1 pad 0.13)
  Top 0.203: LED1.A@1 61.14,47.32 v61.06,47.4
  Bottom 0.203: v61.06,47.4 58.12,47.4 56.69,48.82 R28.2
N$4  (via drill 0.1 pad 0.13)
  Top 0.203: IC1.P$23 46.36,52.85 47.55,51.66 47.55,49.3 47.95,48.9 v47.95,48.54
  Bottom 0.203: v47.95,48.54 48.83,48.54 Q1.3
N$5
  Top 0.203: 34.52,70.18 34.52,69.98
N$6  (via drill 0.1 pad 0.13)
  Top 0.203: v34.09,52.07 34.26,52.07 IC1.P$12
  Bottom 0.203: C20.1 33.71,43.23 35.76,45.29 35.76,49.43 33.63,51.56 33.63,51.97 33.73,52.07 v34.09,52.07
N$7  (via drill 0.1 pad 0.13)
  Top 0.203: v61.77,49.3 61.77,48.41 63.55,46.63 LED2.A@1
  Bottom 0.203: R29.2 57.2,50.52 57.84,51.16 59.89,51.16 59.97,51.08 59.99,51.08 v61.77,49.3
N$8  (via drill 0.1 pad 0.13)
  Top 0.203: v47.24,48.51 43.92,48.51 v43.69,48.28 | v43.08,49.53 IC1.P$22
  Bottom 0.203: Q1.1 47.58,50.52 47.47,50.42 47.47,48.74 v47.24,48.51 | v43.69,48.28 43.13,48.28 43.08,48.34 v43.08,49.53
N$9  (via drill 0.1 pad 0.13)
  Top 0.203: v43.74,63.22 43.33,63.22 43.08,62.97 IC1.P$34
  Bottom 0.203: R27.1 43.75,63.24 v43.74,63.22
N$11  (via drill 0.1 pad 0.13)
  Top 0.203: v34.11,49.33 37.62,49.33 38.28,49.99 IC1.P$16
  Bottom 0.203: C21.2 30.3,42.48 R35.2 30.35,45.26 30.63,45.54 30.63,48.62 31.39,49.38 34.06,49.38 v34.11,49.33
N$13  (via drill 0.1 pad 0.13)
  Top 0.203: v52.53,63.48 52.38,63.48 51.87,62.97 50.22,62.97 49.45,62.2 49.45,59.99 47.9,58.45 IC1.P$30
  Bottom 0.203: R23.1 52.56,63.45 v52.53,63.48
N$14  (via drill 0.1 pad 0.13)
  Top 0.203: v51.77,64.26 51.77,63.5 51.59,63.32 49.23,63.32 48.92,63.02 48.92,60.2 47.95,59.23 44.7,59.23 IC1.P$31
  Bottom 0.203: R24.1 51.4,64.63 v51.77,64.26
N$15  (via drill 0.1 pad 0.13)
  Top 0.203: v48.21,63.3 48.21,60.63 47.65,60.07 44.7,60.07 IC1.P$32
  Bottom 0.203: R25.1 48.26,63.34 v48.21,63.3
N$16  (via drill 0.1 pad 0.13)
  Top 0.203: v47.37,63.63 47.37,61.19 47.04,60.86 IC1.P$33
  Bottom 0.203: R26.1 46.9,64.1 v47.37,63.63
N$17
  Top 0.203: 34.52,69.85 34.49,69.85 34.49,69.93
N$18
  Bottom 0.203: 63.58,58.6 63.7,58.73 63.7,60.71 63.58,60.83
N$19  (via drill 0.1 pad 0.13)
  Top 0.203: IC1.P$24 43.72,53.65 43.54,53.47 43.54,49 43.26,48.72 31.19,48.72 30.5,49.4 v30.15,49.4
  Bottom 0.203: C19.1 28.78,50.57 | 28.78,50.57 28.78,52.35 | 28.78,52.35 28.5,52.63 27.34,52.63 R31.1 27.68,52.62 27.71,52.65 | 27.71,52.65 27.64,52.65 | 27.71,52.65 28.5,52.65 28.55,52.6 28.57,52.6 28.78,52.4 28.78,52.35 | 28.78,50.57 28.96,50.39 28.96,49.84 28.98,49.81 29.29,49.81 29.49,49.61 29.49,49.51 29.62,49.38 30.12,49.38 v30.15,49.4 30.02,49.53
N$20  (via drill 0.08 pad 0.25)
  Top 0.203: IC1.P$25 43.23,54.46 v39.73,54.46
  Bottom 0.203: R30.1 37.64,53.65 37.99,53.21 | 37.99,53.21 38.12,53.03 C18.1 | v39.73,54.46 37.99,53.21
N$21
  Bottom 0.203: 60.5,60.83 60.5,60.66 60.58,60.58 60.55,60.58 59.13,62 60.71,62 60.73,61.98 60.73,61.24 60.43,60.94 60.43,61.82 59.49,61.82 | 59.49,61.82 59.46,61.85 | 59.49,61.82 60.33,60.98 60.33,61.65 60.3,61.67 59.87,61.67 59.84,61.7 59.84,61.67 60.22,61.29 60.22,61.49 60.15,61.57
N$22  (via drill 0.1 pad 0.13)
  Top 0.203: v50.93,51.13 50.93,51.36 50.7,51.59 48.79,51.59 47.8,52.58 47.78,52.58 46.81,53.54 46.15,53.54 45.9,53.8 45.9,55.17 45.44,55.63 45.11,55.63 IC1.P$27
  Bottom 0.203: R28.1 51.38,48.82 50.93,49.28 v50.93,51.13
N$23
  Bottom 0.203: 60.12,63.93 59.49,63.37 60.66,64.39
N$24  (via drill 0.1 pad 0.13)
  Top 0.203: v52.35,50.52 49.35,50.52 47.52,52.35 47.5,52.35 46.61,53.24 45.95,53.24 45.57,53.62 45.57,54.91 45.39,55.09 44.84,55.09 IC1.P$26
  Bottom 0.203: R29.1 v52.35,50.52
N$25
  Bottom 0.203: 60.53,64.57 60.1,63.88
N$28  (via drill 0.1 pad 0.13)
  Top 0.203: IC1.P$42 36.68,61.11 v36.78,61.01
  Bottom 0.203: v36.78,61.01 37.82,61.01 38.04,60.79 R34.1
N$30
  Bottom 0.203: 59.89,63.52 60.53,64.06 60.1,63.5 60.63,63.8 60.38,63.5
N$31
  Bottom 0.203: 60.63,65.41 59.18,66.45
N$32
  Bottom 0.203: 60.17,65.76 60.55,64.82 60.45,65.56
N$33
  Bottom 0.203: 60.55,65.66 59.26,66.57 59.33,66.75 60.6,65.81 60.43,66.27 59.26,66.95 60.43,66.09 60.43,66.83 59.31,67.28 59.38,66.9 59.51,67.06 60.38,66.47 59.94,66.88 60.4,66.62 59.13,66.29 59.56,66.24 59.11,66.27
N$34
  Bottom 0.203: 59.72,66.75 59.49,66.9
N$35
  Bottom 0.203: 57.58,65.08 58.32,66.34
N$36
  Bottom 0.203: 58.01,65.81 58.67,66.29
N$37  (via drill 0.1 pad 0.13)
  Top 0.203: v34.77,60.68 34.77,60.1 34.75,60.07 33.5,60.07 IC1.P$2
  Bottom 0.203: C17.2 34.75,60.71 v34.77,60.68
N$38
  Bottom 0.203: 59.69,63.45 57.45,63.45
N$39
  Bottom 0.203: 57.63,63.48 57.66,63.48 57.66,65.28
N$40
  Bottom 0.203: JP3.3 47.07,43.66 47.22,43.81 J2.5
N$41  (via drill 0.1 pad 0.13)
  Top 0.203: SJ1.2 24.74,39.06 v24.46,38.79
  Top 0.508: U$2.P$9 40.23,32.31 v39.62,32.92
  Bottom 0.203: v24.46,38.79 24.46,35.97 D1.A 23.76,35.95 23.44,35.64 23.44,32.92 24.16,32.21 25.18,32.21 C30.2
  Bottom 0.508: v39.62,32.92 32.89,32.92 31.34,31.37 28.87,31.37 C31.2 26.44,31.12 C30.2
N$42
  Bottom 0.203: 57.73,63.7 59.99,63.75 57.76,63.55 59.72,63.58 59.89,63.98 60.48,64.8 60.02,63.96 60.35,65.2 60.38,64.72 59.44,66.19 60.43,65.23 60.07,65.3 60.2,65.02 59.31,66.14 | 59.31,66.14 59.26,65.89 57.56,65.35 57.66,66.12 59.31,66.14 | 59.31,66.14 59.08,65.86 58.52,65.99 59.18,65.94 57.99,65.66 58.5,65.94 57.81,65.96 57.73,65.53 57.94,65.84 57.86,65.08 57.78,64.34 57.89,63.78 57.78,63.83 57.96,64.49 58.01,63.8 58.4,63.86 58.09,64.01 58.04,65.43 57.96,64.36 58.6,63.75 59.87,63.91 60.15,64.87
N$48  (via drill 0.1 pad 0.13)
  Top 0.203: D3.C 20.09,32.65 D2.C
  Top 0.508: D4.C 20.07,32.63 D2.C | v19.79,35.33 19.79,33.01 D2.C | U$2.P$1 v33.23,38.76 v33.22,38.76 | v33.25,35.36 33.25,34.85 30.86,32.46 26.64,32.46 v22.96,28.78 | v20.98,28.75 20.98,31.81 D2.C
  Bottom 0.508: C29.2 19.69,37.08 C28.2 19.77,35.35 v19.79,35.33 | v33.22,38.76 33.22,35.38 v33.25,35.36 | v22.96,28.78 21.01,28.78 v20.98,28.75
N$49
  Bottom 0.203: JP3.1 45.44,43.2 44.7,43.94 44.7,46.1 J2.6
N$60  (via drill 0.1 pad 0.13)
  Top 0.203: v22.81,40.87 22.81,41.27 SJ1.1
  Bottom 0.203: R44.1 23.2,29.6 22.81,30 v22.81,40.87
PM0
  Bottom 0.203: 27.33,49.84 R31.2 26.71,51.32 26.21,50.83 25.43,50.83 25.02,50.42 24.54,50.42 24.23,50.72 24.23,50.98 24.13,51.08 23.32,51.08 JP1.2 | 27.33,49.84 27.33,48.4 R33.2 | 27.3,49.86 27.33,49.84
PM1
  Bottom 0.203: R32.2 R30.2 35.97,52.53 31.83,52.53 31.39,52.05 31.39,49.38 31.95,49.38 JP7.2
SCK  (via drill 0.1 pad 0.13)
  Top 0.203: J1.6 44.2,27.94 41.86,27.94 38.18,31.62 38.18,36.58 37.06,37.69 19.58,37.69 17.3,39.98 17.3,72.29 17.96,72.95 31.85,72.95 32.81,71.99 32.89,71.91 32.16,71.14 JP8.1 | v60.6,71.09 60.6,71.7 57.78,74.52 v53.24,74.52
  Bottom 0.203: J1.6 46.48,26.62 48.03,28.17 50.14,28.17 50.6,28.63 62.94,28.63 63.98,29.67 63.98,67.72 v60.6,71.09 | v53.24,74.52 49.82,74.52 R40.2
SCL
  Top 0.203: X5.2 55.73,37.57 54.84,38.46 J2.2
SDA
  Top 0.203: X5.3 60.07,35.59 61.49,38.89 61.49,40.36 57.38,43.08 J2.1
UA  (via drill 0.1 pad 0.13)
  Top 0.508: D2.A 20.12,29.06 v20.14,29.03 | v25.68,46.61 25.68,62.33 v25.5,62.51
  Bottom 0.508: X1.4 19.76,64.78 R15.2 25.5,63.52 v25.5,62.51 | v20.14,29.03 20.14,33.96 21.08,34.9 21.08,43.43 23.32,45.67 24.74,45.67 v25.68,46.61
UAP  (via drill 0.1 pad 0.13)
  Top 0.203: v31.67,62.36 31.67,62.2 32.84,61.04 32.84,52.27 34.49,50.62 35.59,50.62 35.59,50.96 IC1.P$13
  Bottom 0.203: R15.1 27.14,64.78 28.25,63.68 29.93,63.68 C9.1 | R16.1 31.65,62.38 v31.67,62.36
  Bottom 0.508: R15.1 27.09,64.76 28.17,63.68 28.25,63.68 31.63,63.68 R16.1
UB  (via drill 0.1 pad 0.13)
  Top 0.508: D3.A v18.14,28.98 | v24.61,51.23 24.61,57.48 v24.49,57.61
  Bottom 0.508: R19.2 | v18.14,28.98 18.14,46.56 19.68,48.11 19.71,48.11 20.27,48.67 20.98,48.67 22.12,49.81 22.12,50.75 22.5,51.13 24.51,51.13 v24.61,51.23 | v24.49,57.61 24.49,59.61 R19.2 | R19.2 X1.3
UBP  (via drill 0.1 pad 0.13)
  Top 0.203: v31.83,57.66 31.83,57.61 32.51,56.92 32.51,52.12 34.31,50.32 36.12,50.32 36.45,50.65 36.45,51.02 IC1.P$14
  Bottom 0.203: R20.1 31.77,57.71 v31.83,57.66
  Bottom 0.508: R19.1 26.82,60.05 27.89,58.98 30.04,58.98 C11.1 R20.1
UC  (via drill 0.1 pad 0.13)
  Top 0.508: D4.A 16.46,29.01 v16.43,28.98
  Bottom 0.508: R17.1 19.45,55.17 X1.2 16.43,52.15 v16.43,28.98
UCP  (via drill 0.1 pad 0.13)
  Top 0.203: IC1.P$15 37.16,50.93 37.16,50.67 36.5,50.01 34.16,50.01 31.77,52.4 30.58,52.4 v30.2,52.78
  Bottom 0.203: R18.2 v30.2,52.78 | C10.1 28.51,54.11 28.5,54.13
  Bottom 0.508: R17.2 26.67,55.17 27.71,54.13 28.5,54.13 30.14,54.13 R18.2
UN  (via drill 0.04 pad 0.13, 0.1 pad 0.13)
  Top 0.203: v24.03,44.91 v22.71,46.23 | v19.63,46.66 19.63,46.71 v18.26,48.08 | v25.76,35.36 25.76,33.17 v25.83,33.1 | v27.51,31.75 27.51,30.73 v27.18,30.4
  Top 0.508: X1.1 19.41,49.23 v18.26,48.08 | U$2.P$5 43.38,39.22 v42.72,38.56
  Bottom 0.203: v24.03,44.91 24.08,44.86 26.77,44.86 26.87,44.76 26.87,39.04 LED3.C@1 26.1,35.7 v25.76,35.36 | v22.71,46.23 20.75,46.23 20.27,45.74 20.27,38.95 C28.1 20.24,38.94 20.24,45.7 20.3,45.74 20.3,46 v19.63,46.66 | v18.26,48.08 18.11,48.08 17.45,47.42 17.45,38.59 C29.1 | v25.83,33.1 26.16,33.1 v27.51,31.75 | v27.18,30.4 27.02,30.4 C30.1 28.54,29.74 C31.1
  Bottom 0.508: v42.72,38.56 35.41,38.56 34.01,39.95 31.27,39.95 30.4,39.09 26.87,39.09 26.87,39.04
USB  (via drill 0.04 pad 0.13)
  Top 0.203: v33.71,44.12 32.79,44.12 32.44,43.76 32.44,43 31.73,42.29 v31.73,38.58
  Bottom 0.203: J2.10 34.52,45.9 33.71,45.09 v33.71,44.12 | v31.73,38.58 31.73,35.41 29.95,33.63 24.9,33.63 D1.C
V_CLK  (via drill 0.1 pad 0.13)
  Top 0.203: v50.09,72.69 39.85,72.69 39.27,72.11 39.27,62.64 IC1.P$39
  Bottom 0.203: C24.2 52.29,73.23 52.27,73.25 52.27,73.28 51.69,73.86 R40.1 50.46,73.06 v50.09,72.69
V_CS  (via drill 0.1 pad 0.13)
  Top 0.203: v39.93,68.89 39.93,62.5 IC1.P$38
  Bottom 0.203: R41.1 46.15,73.86 46.46,73.56 46.46,73.28 46.44,73.27 C23.2 40.69,72.11 40.62,72.03 40.44,72.03 39.88,71.48 39.88,68.94 v39.93,68.89
V_MISO  (via drill 0.1 pad 0.13)
  Top 0.203: v38.28,66.22 IC1.P$40
  Bottom 0.203: R38.1 60.44,71.94 59.49,70.99 53.37,70.99 53.06,71.3 47.17,71.3 47.02,71.45 43.36,71.45 42.32,70.41 42.32,69.27 40.64,67.59 38.94,67.59 38.28,66.93 v38.28,66.22
V_MOSI  (via drill 0.1 pad 0.13)
  Top 0.203: v54,72.75 51.21,72.75 50.32,71.86 42.75,71.86 v42.29,71.4 | v37.47,66.6 37.47,62.47 IC1.P$41
  Bottom 0.203: C25.2 58.67,73.13 58.04,73.76 R39.1 57.16,73.42 56.49,72.75 v54,72.75 | v42.29,71.4 42.27,71.4 40.82,69.95 40.82,68.38 40.41,67.97 38.86,67.97 38.33,67.44 38.3,67.44 v37.47,66.6
ZX0  (via drill 0.1 pad 0.13)
  Top 0.203: JP5.1 45.85,67.72 45.01,66.9 v45.01,65.46
  Bottom 0.203: v45.01,65.46 45.01,64.49 45.62,63.88 45.62,63.83 R27.2
ZX1  (via drill 0.08 pad 0.25)
  Top 0.203: 47.52,65.94 v47.52,65.91 46.66,66.4 JP5.2
  Bottom 0.203: R26.2 47.62,64.97 47.52,65.15 v47.52,65.91
ZX2  (via drill 0.08 pad 0.25)
  Top 0.203: JP5.3 47.47,67.54 48.06,66.98 48.08,65.1 48.39,64.77 v49.71,64.77
  Bottom 0.203: v49.71,64.77 R25.2
(copper drawn outside any net)
  shapes: Bottom area x45